# Altium schematic sheet usb board.SchDoc
size A4
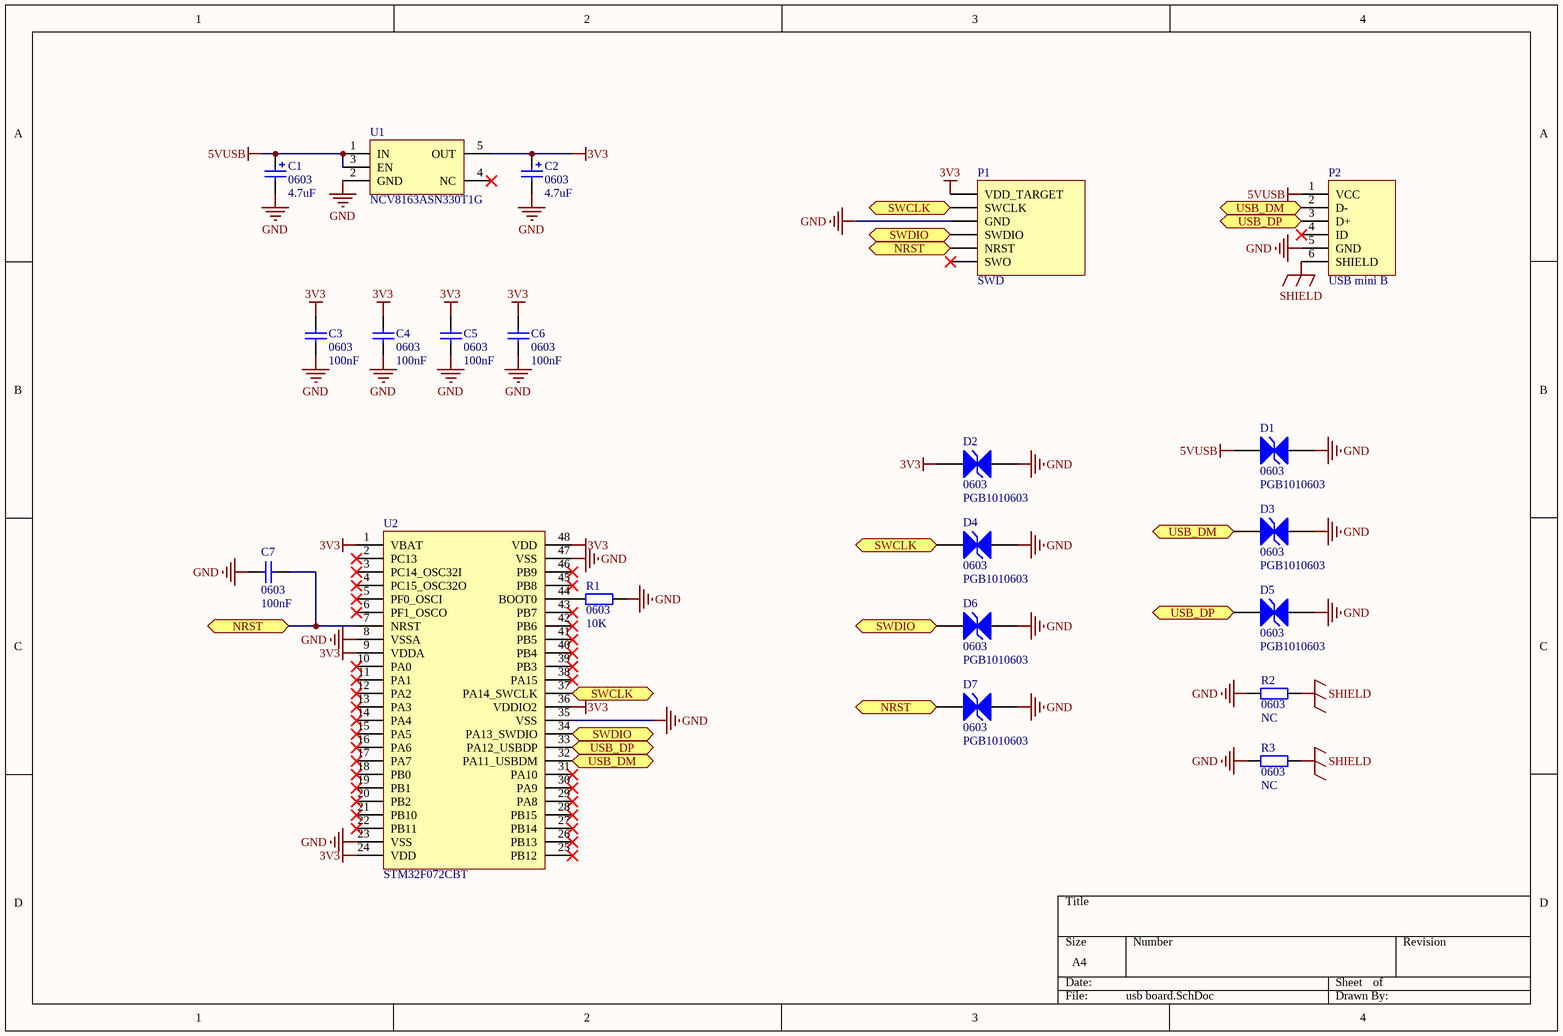
[diagram p0: usb board.SchDoc]

## Parts
C1  0603  value 4.7uF  [diode_0603_HandSoldering]
C2  0603  value 4.7uF  [diode_0603_HandSoldering]
C3  0603  value 100nF  [0603_HandSoldering]
C4  0603  value 100nF  [0603_HandSoldering]
C5  0603  value 100nF  [0603_HandSoldering]
C6  0603  value 100nF  [0603_HandSoldering]
C7  0603  value 100nF  [0603_HandSoldering]
D1  0603  value PGB1010603  [0603_HandSoldering]
D2  0603  value PGB1010603  [0603_HandSoldering]
D3  0603  value PGB1010603  [0603_HandSoldering]
D4  0603  value PGB1010603  [0603_HandSoldering]
D5  0603  value PGB1010603  [0603_HandSoldering]
D6  0603  value PGB1010603  [0603_HandSoldering]
D7  0603  value PGB1010603  [0603_HandSoldering]
P1  SWD  [HDR1X6]
P2  USB mini B  [USB mini B receptacle]
R1  0603  value 10K  [0603_HandSoldering]
R2  0603  value NC  [0603_HandSoldering]
R3  0603  value NC  [0603_HandSoldering]
U1  NCV8163ASN330T1G  [NCV8163ASN330T1G_SOT32_5]
U2  STM32F072CBT  [LQFP48]

## Ports
NRST, SWCLK, SWDIO, USB_DM, USB_DP

## Nets
3V3: C2.1 C3.2 C4.2 C5.2 C6.2 D2.1(A) P1.1(VDD_TARGET) U1.5(OUT) U2.1(VBAT) U2.9(VDDA) U2.24(VDD) U2.36(VDDIO2) U2.48(VDD)
5VUSB: C1.1 D1.1(A) P2.1(VCC) U1.1(IN) U1.3(EN)
GND: C1.2 C2.2 C3.1 C4.1 C5.1 C6.1 C7.1 D1.2(K) D2.2(K) D3.2(K) D4.2(K) D5.2(K) D6.2(K) D7.2(K) P1.3(GND) P2.5(GND) R1.2 R2.1 R3.1 U1.2(GND) U2.8(VSSA) U2.23(VSS) U2.35(VSS) U2.47(VSS)
SHIELD: P2.6(SHIELD) R2.2 R3.2
NRST: C7.2 D7.1(A) P1.5(NRST) U2.7(NRST) ; port NRST
SWCLK: D4.1(A) P1.2(SWCLK) U2.37(PA14_SWCLK) ; port SWCLK
SWDIO: D6.1(A) P1.4(SWDIO) U2.34(PA13_SWDIO) ; port SWDIO
USB_DM: D3.1(A) P2.2(D-) U2.32(PA11_USBDM) ; port USB_DM
USB_DP: D5.1(A) P2.3(D+) U2.33(PA12_USBDP) ; port USB_DP
NetR1_1: R1.1 U2.44(BOOT0)

Not connected (* = marked no-connect by the designer): P1 6(SWO)*; P2 4(ID)*; U1 4(NC)*; U2 2(PC13)* 3(PC14_OSC32I)* 4(PC15_OSC32O)* 5(PF0_OSCI)* 6(PF1_OSCO)* 10(PA0)* 11(PA1)* 12(PA2)* 13(PA3)* 14(PA4)* 15(PA5)* 16(PA6)* 17(PA7)* 18(PB0)* 19(PB1)* 20(PB2)* 21(PB10)* 22(PB11)* 25(PB12)* 26(PB13)* 27(PB14)* 28(PB15)* 29(PA8)* 30(PA9)* 31(PA10)* 38(PA15)* 39(PB3)* 40(PB4)* 41(PB5)* 42(PB6)* 43(PB7)* 45(PB8)* 46(PB9)*

## Library data of the parts
C1 C2 = Tantalum Capacitor
C3-C7 = Capacitor
D1-D7 = PGB1010603: ESD diode
P1 = SWD Header: STM32 SWD Header
P2 = USB mini B: USB 2.0 mini B receptacle
R1-R3 = Resistor
U1 = NCV8163ASN330T1G: 3V3 LDO
U2 = STM32F072CBT: ARM Cortex M0 MCU